# Altium schematic sheet PMP9517.SchDoc: Main Sheet
size 431 x 279 mm; Date: Not shown in title block; ApprovedBy: Not shown in title block; CheckedBy: Not shown in title block; Author: Not shown in title block; CompanyName: Not shown in title block; DrawnBy: Brian Gaynor; Engineer: Not shown in title block; Organization: Not shown in title block; Address1: Not shown in title block; Address2: Not shown in title block; Address3: Not shown in title block; Address4: Not shown in title block; DocumentNumber: 1; Revision: Use project parameter SCH_Rev; SheetNumber: 1; SheetTotal: 2; PageSetup: Record=PageOptions|CenterHorizontal=True|CenterVertical=True|PrintScale=0.66|XCorrection=1.00|YCorrection=1.00|PrintKind=0|BorderSize=5000000|LeftOffset=0|BottomOffset=0|Orientation=2|PaperLength=1000|PaperWidth=1000|Scale=100|PaperSource=15|PrintQuality=600|MediaType=1|DitherType=10|PaperKind=Letter|PrintScaleMode=1; CurrentTime: Not shown in title block; CurrentDate: Not shown in title block; Time: Not shown in title block; DocumentFullPathAndName: Not shown in title block; DocumentName: Not shown in title block; ModifiedDate: Not shown in title block; ImagePath: Not shown in title block
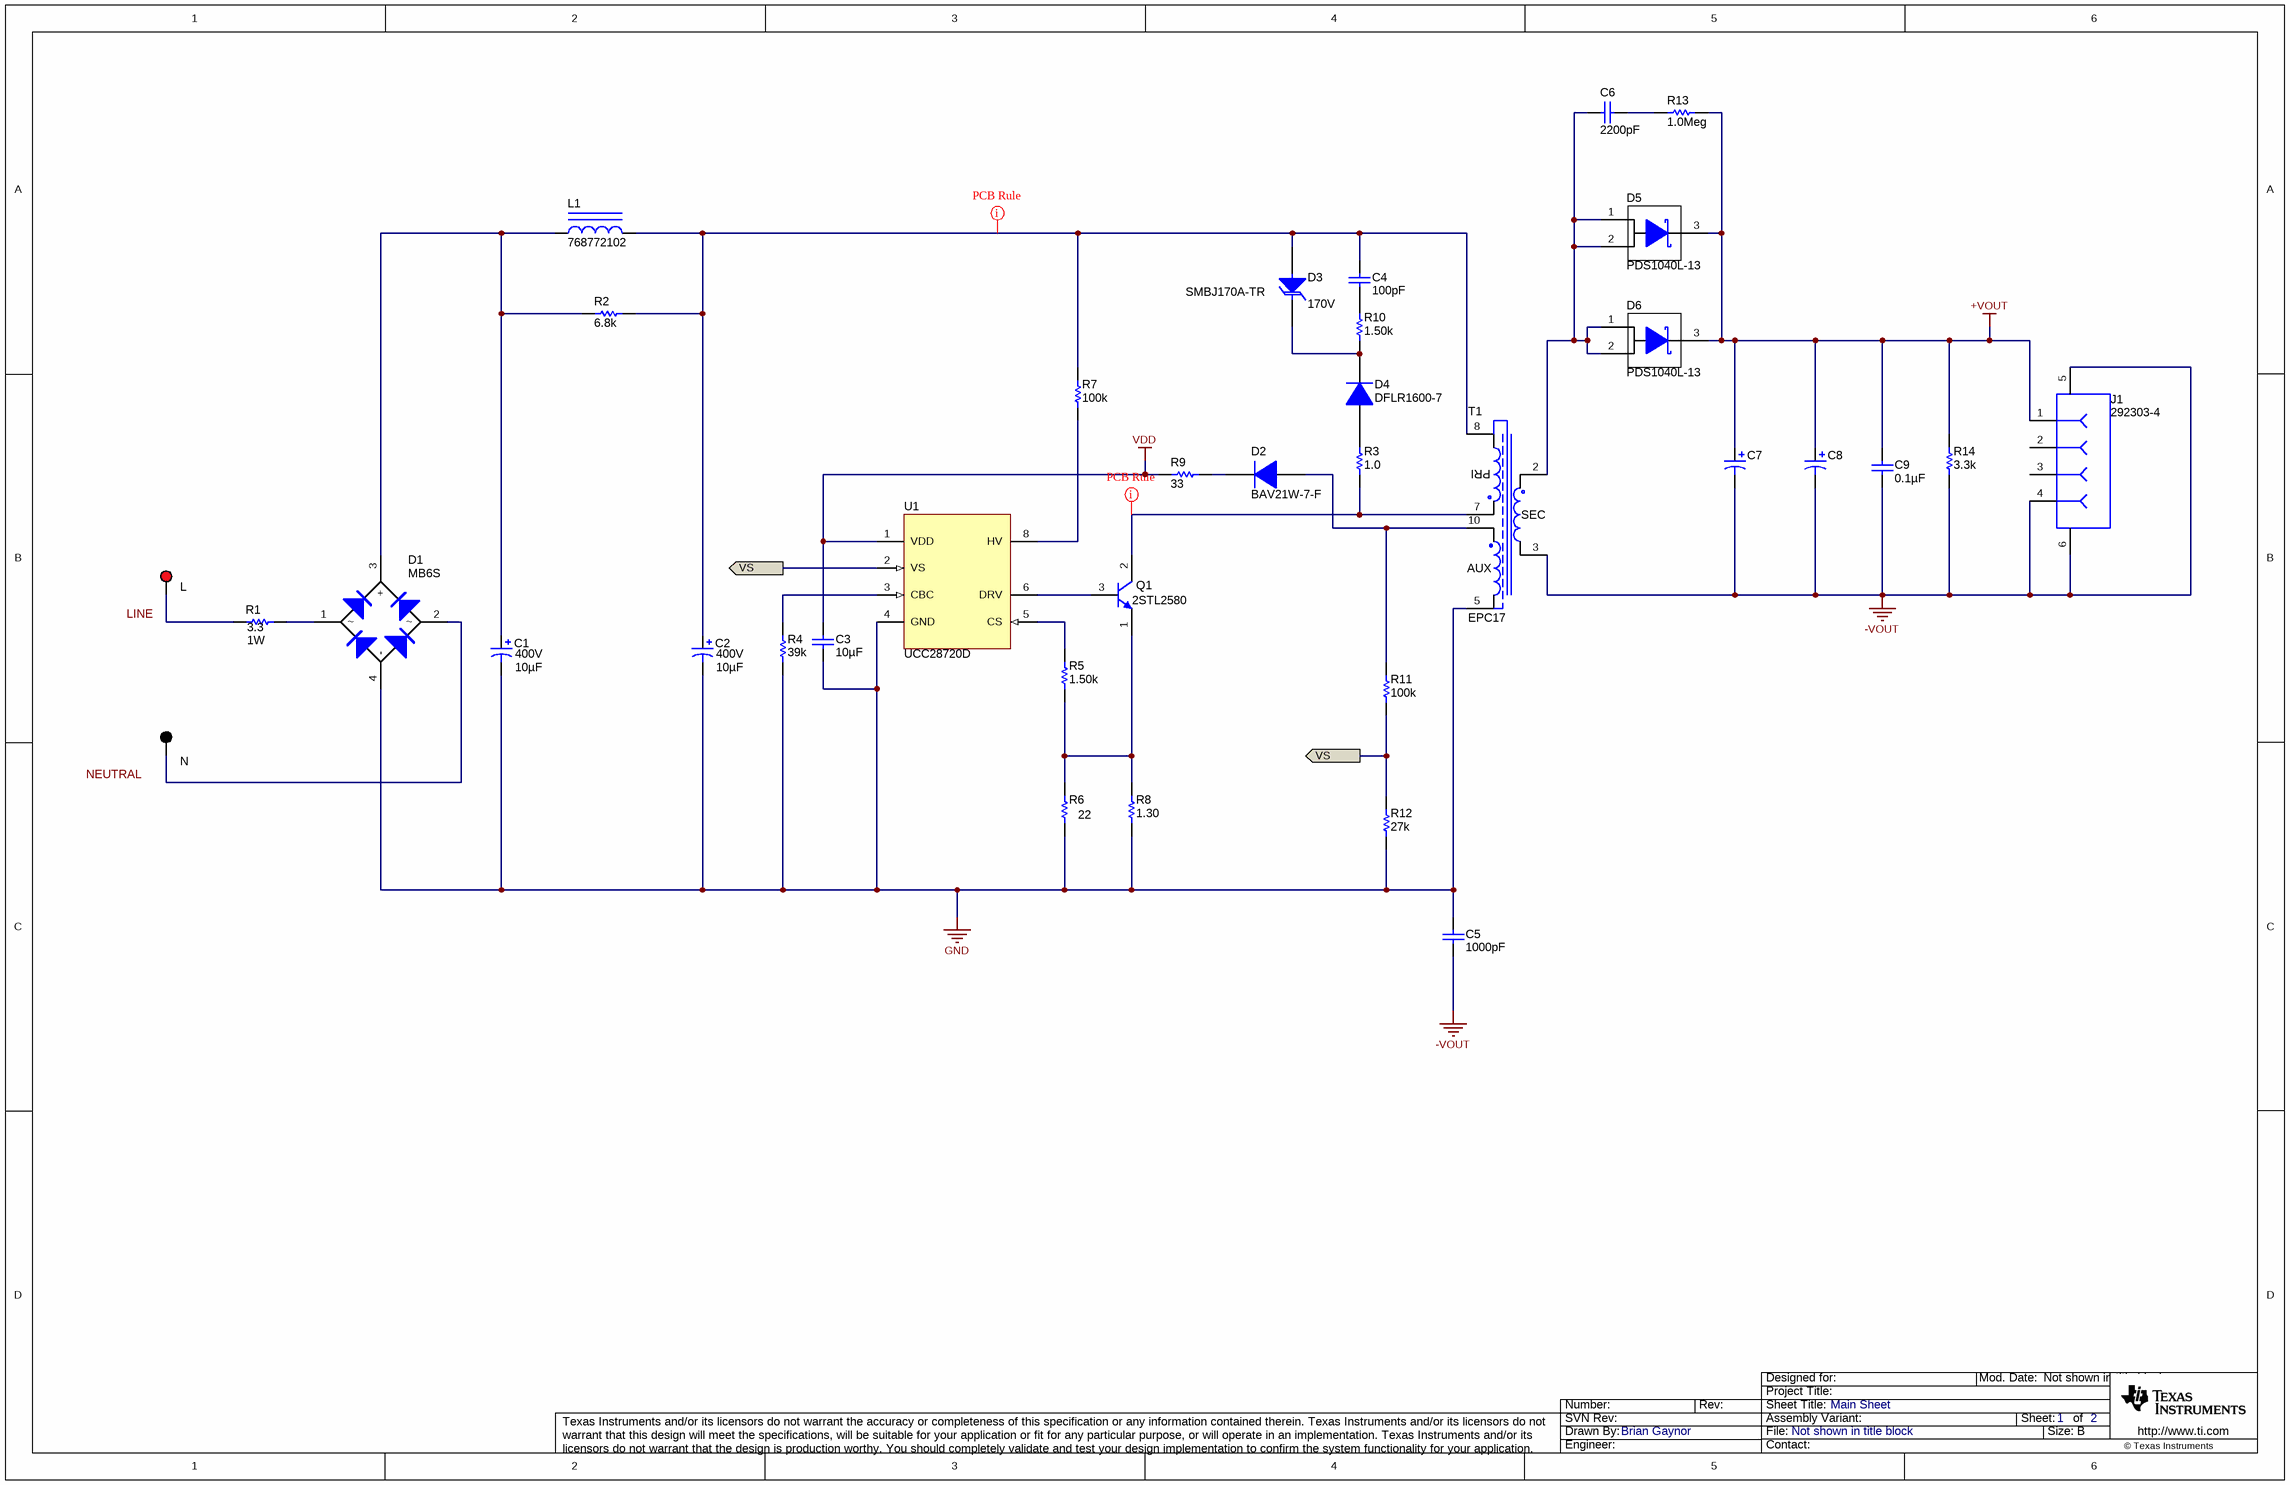
[diagram p0: PMP9517.SchDoc]

## Parts
C1  value 10µF  VDC_V: 400V  [CAPPRD500W60D1000H1250]  (hidden comment: UVC2G100MPD)
C2  value 10µF  VDC_V: 400V  [CAPPRD500W60D1000H1250]  (hidden comment: UVC2G100MPD)
C3  ValueDisplayed: 10µF  [1210]  (hidden comment: 1210YD106KAT2A)
C4  ValueDisplayed: 100pF  [1206]  (hidden comment: C1206C101JCGACTU)
C5  ValueDisplayed: 1000pF  [CAPRD750W60D750H1050]  (hidden comment: VY2102M29Y5UG63V7)
C6  ValueDisplayed: 2200pF  [0805_HV]  (hidden comment: 08055C222KAT2A)
C7  RNE0J122MDN1PX  [NRE-AX_800x1080]  (value not drawn)
C8  CAP ALUM 1200UF 6.3V 20% RADIAL  [NRE-AX_800x1080]  (value not drawn)
C9  ValueDisplayed: 0.1µF  [0805_HV]  (hidden comment: 08055C104JAT2A)
D1  MB6S  [MiniDIP-MB6S]
D2  BAV21W-7-F  [SOD-123]
D3  SMBJ170A-TR  value 170V  [SMB]
D4  DFLR1600-7  [powerDI123]
D5  PDS1040L-13  [powerdi5]
D6  PDS1040L-13  [powerdi5]
J1  292303-4  [CONN_TE_292303-4]
L  5005  [Keystone5005]  (value not drawn)
L1  768772102  [IND_WE-TI_8095]
N  5006  [Keystone5006]  (value not drawn)
Q1  2STL2580  [TO-92_AllBent]
R1  value 3.3  Power_W: 1W  [RES_ERG1S_V]  (hidden comment: SPP1UL3R30JLF)
R2  value 6.8k  [0805_HV]  (hidden comment: CRCW08056K80JNEA)
R3  value 1.0  [1206]  (hidden comment: CRCW12061R00JNEA)
R4  value 39k  [0603]  (hidden comment: CRCW060339K0JNEA)
R5  value 1.50k  [0603]  (hidden comment: CRCW06031K50FKEA)
R6  value 22  [2512M]  (hidden comment: CRCW251222R0JNEGHP)
R7  value 100k  [1206]  (hidden comment: RC1206FR-07100KL)
R8  value 1.30  [2512M]  (hidden comment: ERJ-1TRQF1R3U)
R9  value 33  [0603]  (hidden comment: CRCW060333R0JNEA)
R10  value 1.50k  [1206]  (hidden comment: CRCW12061K50FKEA)
R11  value 100k  [0603]  (hidden comment: CRCW0603100KFKEA)
R12  value 27k  [0603]  (hidden comment: RC0603JR-0727KL)
R13  value 1.0Meg  [0805_HV]  (hidden comment: CRCW08051M00JNEA)
R14  value 3.3k  [0805_HV]  (hidden comment: CRCW08053K30JNEA)
T1  EPC17  [MAG\TH\EPC17]
U1  UCC28720D  [D0007A_N]

## Ports
VS

## Nets
+VOUT: C7.1(+) C8.1(+) C9.2 D5.3(K) D6.3(K) J1.1 R13.2 R14.2
-VOUT: C5.2 C7.2(-) C8.2(-) C9.1 J1.4 J1.5 J1.6 R14.1 T1.3
GND: C1.2(-) C2.2(-) C3.2 C5.1 D1.4(-) R4.1 R6.1 R8.1 R12.1 T1.5 U1.4(GND)
VDD: C3.1 R9.1 U1.1(VDD)
VS: R11.1 R12.2 U1.2(VS) ; port VS
NetC1_1: C1.1(+) D1.3(+) L1.1 R2.1
NetC2_1: C2.1(+) C4.1 D3.2(A) L1.2 R2.2 R7.1 T1.8
NetC4_2: C4.2 R10.2
NetC6_1: C6.1 D5.1(A) D5.2(A) D6.1(A) D6.2(A) T1.2
NetC6_2: C6.2 R13.1
NetD1_1: D1.1 R1.2
NetD1_2: D1.2 N.1
NetD2_1: D2.1(K) R9.2
NetD2_2: D2.2(A) R11.2 T1.10
NetD3_1: D3.1(K) D4.1(K) R10.1
NetD4_2: D4.2(A) R3.2
NetL_1: L.1 R1.1
NetQ1_1: Q1.1(B) R5.1 R6.2 R8.2
NetQ1_2: Q1.2(C) R3.1 T1.7
NetQ1_3: Q1.3(E) U1.6(DRV)
NetR4_2: R4.2 U1.3(CBC)
NetR5_2: R5.2 U1.5(CS)
NetR7_2: R7.2 U1.8(HV)

Not connected (* = marked no-connect by the designer): J1 2 3

## Layout directives
rule Clearance Constraint [Clearance = 1mm]: NetC2_1, NetQ1_2

## Notes on the sheet
- Labels drawn without touching a wire or pin: LINE, NEUTRAL
- Drawn By:
- SVN Rev:
- Number:
- Rev:
- Sheet Title:
- File:
- Project Title:
- Designed for:
- Assembly Variant:
- Mod. Date:
- Sheet:
- Size:
- of
- B
- http://www.ti.com
- Texas Instruments and/or its licensors do not warrant the accuracy or completeness of this specification or any information contained therein. Texas Instruments and/or its licensors do not warrant that this design will meet the specifications, will be suitable for your application or fit for any particular purpose, or will operate in an implementation. Texas Instruments and/or its licensors do not warrant that the design is production worthy. You should completely validate and test your design implementation to confirm the system functionality for your application.
- Engineer:
- Contact:
- © Texas Instruments
- (in symbol EPC17) PRI; SEC; AUX

## Library data of the parts
C1 C2 = Capacitor_Polarized: CAP, [Technology], xxxF, xxV, +/-xx%, xxOhm ESR, [MountType]; Manufacturer: Nichicon; Description: CAP ALUM 10UF 400V 20% RADIAL; Ripple Current: 100mA; Lifetime @ Temp.: 2000 Hrs @ 105°C; Tolerance_%: ±20%; PartNumber: UVC2G100MPD; Supplier Part Number: 493-6677-ND; Category: Capacitors; Supplier: Digi-Key; Impedance: -; MountType: Through Hole; Height - Seated (Max): 0.571" (14.50mm); Lead Spacing: 0.197" (5.00mm); Packaging: Bulk; Applications: General Purpose; Surface Mount Land Size: -; Size / Dimension: 0.394" Dia (10.00mm); PackageReference: Radial, Can; ESR_Ohm: -; Operating Temperature: -40°C ~ 105°C; Type: -; RoHS: RoHS Compliant
C3 = 1210YD106KAT2A: CAP, CERM, 10uF, 16V, +/-10%, X5R, 1210; Manufacturer: AVX; Polarized: N; CompType: Capacitor; U/M: EA; Cap_F: 0.00001; Tolerance_%: 10; Value1: Unknown; VDC_V: 16; TaMin_C: -55; TaMax_C: 85; SymbolVersion: 2008-07-09; Value: 10uF; PackageReference: 1210; PartNumber: 1210YD106KAT2A; RoHS: Y; MountType: SMT; ComponentLink1Description: Datasheet link; ComponentLink1URL: http://www.avx.com/docs/Catalogs/cx5r.pdf; Publisher: Texas Instruments; LatestRevisionDate: 2013-06-21; Value2: 16V; Technology: Ceramic; Cap_Case: 1210; Supplier 1: Digi-Key; Supplier Part Number 1: 478-1629-1-ND; Supplier 2: Mouser; Supplier Part Number 2: 581-1210YD106K; Supplier 3: Newark; Supplier Part Number 3: 10R6031; TempCo: X5R; Published: 2008-06-19
C4 = C1206C101JCGACTU: CAP, CERM, 100pF, 500V, +/-5%, C0G/NP0, 1206; Manufacturer: Kemet; Polarized: N; CompType: Capacitor; U/M: EA; Cap_F: 0.0000000001; Tolerance_%: 5; Value1: Unknown; VDC_V: 500; TaMin_C: -55; TaMax_C: 125; SymbolVersion: 2008-07-09; Value: 100pF; PackageReference: 1206; PartNumber: C1206C101JCGACTU; RoHS: Y; MountType: SMT; ComponentLink1Description: Datasheet link; ComponentLink1URL: http://www.kemet.com/datasheets&C1206C101JCGACTU; Publisher: Texas Instruments; LatestRevisionDate: 2013-03-03; LatestRevisionNote: Changed publisher; Value2: 500V; Technology: Ceramic; TempCo: C0G/NP0; Cap_Case: 1206; Published: 2008-06-19; Supplier 1: Digi-Key; Supplier Part Number 1: 399-7073-2-ND; Supplier 2: Mouser; Supplier Part Number 2: 80-C1206C101JCG; Supplier 3: Newark; Supplier Part Number 3: 13K5663
C5 = VY2102M29Y5UG63V7: CAP, CERM, 1000pF, 300V, +/-20%, Y5U, Radial Disc 7.5mm, ls=7.5; Manufacturer: Vishay-Bccomponents; Polarized: N; CompType: Capacitor; U/M: EA; Cap_F: 0.000000001; Tolerance_%: 20; Value1: Unknown; VDC_V: 300; TaMin_C: -40; TaMax_C: 125; SymbolVersion: 2008-07-09; Value: 1000pF; PartNumber: VY2102M29Y5UG63V7; PackageReference: Radial Disc 7.5mm, ls=7.5; RoHS: Y; Value2: 300V; MountType: TH; Technology: Ceramic; TempCo: Y5U; Cap_Case: Radial Disc 7.5mm, ls=7.5; Published: 2008-06-19; Publisher: Texas Instruments; LatestRevisionDate: 2013-09-06; ComponentLink1Description: Datasheet link; ComponentLink1URL: http://www.vishay.com/docs/28535/emirfiy2.pdf; Supplier 1: Digi-Key; Supplier Part Number 1: BC2752-ND; Supplier 2: Mouser; Supplier Part Number 2: 72-VY2102M29Y5UG63V7; Supplier 3: Farnell; Supplier Part Number 3: 1902243
C6 = 08055C222KAT2A: CAP, CERM, 2200pF, 50V, +/-10%, X7R, 0805; Manufacturer: AVX; Polarized: N; CompType: Capacitor; U/M: EA; Cap_F: 0.0000000022; Tolerance_%: 10; ESR_Ohm: 0.183; Value1: 0.183 ohm; VDC_V: 50; TaMin_C: -55; TaMax_C: 125; Cap_Case: 0805; SymbolVersion: 2008-07-09; Value: 2200pF; PartNumber: 08055C222KAT2A; PackageReference: 0805; RoHS: Y; Value2: 50V; MountType: SMT; Technology: Ceramic; TempCo: X7R; Published: 2008-06-19; Publisher: Texas Instruments; LatestRevisionDate: 2013-03-03; LatestRevisionNote: Changed publisher; ComponentLink1Description: Datasheet link; ComponentLink1URL: http://www.avx.com/docs/masterpubs/smccp.pdf; Supplier 1: Digi-Key; Supplier Part Number 1: 478-1375-1-ND; Supplier 2: Mouser; Supplier Part Number 2: 581-08055C222K; Supplier 3: Farnell; Supplier Part Number 3: 498610
C7 = Capacitor_Polarized: CAP, [Technology], xxxF, xxV, +/-xx%, xxOhm ESR, [MountType]; Manufacturer: Nichicon; Ripple Current: 5.7A; Tolerance_%: ±20%; Description: CAP ALUM 1200UF 6.3V 20% RADIAL; Type: Polymer; Lifetime @ Temp.: 2000 Hrs @ 105°C; Value: 1200µF; ESR_Ohm: 10 mOhm; VDC_V: 6.3V; MountType: Through Hole; PackageReference: Radial, Can; PartNumber: RNE0J122MDN1PX; Category: Capacitors; Applications: -; RoHS: RoHS Compliant; Impedance: -; Operating Temperature: -55°C ~ 105°C; Lead Spacing: 0.138" (3.50mm); Supplier: Digi-Key; Surface Mount Land Size: -; Height - Seated (Max): 0.354" (9.00mm); Size / Dimension: 0.315" Dia (8.00mm); Packaging: Tape & Reel (TR); Supplier Part Number: 493-3811-2-ND
C8 = Capacitor_Polarized: CAP, [Technology], xxxF, xxV, +/-xx%, xxOhm ESR, [MountType]; PartNumber: RNE0J122MDN1PX; Manufacturer: Nichicon; Ripple Current: 5.7A; Type: Polymer; Lifetime @ Temp.: 2000 Hrs @ 105°C; Value: 1200µF; ESR_Ohm: 10 mOhm; MountType: Through Hole; PackageReference: Radial, Can; Category: Capacitors; Tolerance_%: ±20%; Description: CAP ALUM 1200UF 6.3V 20% RADIAL; Applications: -; RoHS: RoHS Compliant; Impedance: -; Operating Temperature: -55°C ~ 105°C; Lead Spacing: 0.138" (3.50mm); Supplier: Digi-Key; Surface Mount Land Size: -; Height - Seated (Max): 0.354" (9.00mm); Size / Dimension: 0.315" Dia (8.00mm); Packaging: Tape & Reel (TR); VDC_V: 6.3V; Supplier Part Number: 493-3811-2-ND
C9 = 08055C104JAT2A: CAP, CERM, 0.1uF, 50V, +/-5%, X7R, 0805; Manufacturer: AVX; Polarized: N; CompType: Capacitor; U/M: EA; Cap_F: 0.0000001; Tolerance_%: 5; ESR_Ohm: 0.024; Value1: 0.024 ohm; VDC_V: 50; TaMin_C: -55; TaMax_C: 125; Cap_Case: 0805; SymbolVersion: 2008-07-09; Value: 0.1uF; PartNumber: 08055C104JAT2A; PackageReference: 0805; RoHS: Y; Value2: 50V; MountType: SMT; Technology: Ceramic; TempCo: X7R; Published: 2008-06-19; Publisher: Texas Instruments; LatestRevisionDate: 2013-07-02; ComponentLink1Description: Datasheet link; ComponentLink1URL: http://www.avx.com/docs/masterpubs/smccp.pdf; Supplier 1: Digi-Key; Supplier Part Number 1: 478-3352-1-ND; Supplier 2: Mouser; Supplier Part Number 2: 581-08055C104J; Supplier 3: Farnell; Supplier Part Number 3: 1740673
D1 = MB6S: Diode, Switching-Bridge, 600V, 1A, TH; U/M: EA; Io_A: 1; CompType: Diode; PackageReference: Diodge Bridge; PartNumber: MB6S; RoHS: Y; MountType: TH; ComponentLink1Description: Datasheet link; Type: Switching-Bridge; Supplier 1: Mouser; Supplier Part Number 1: 512-MB6S
D2 = BAV21W-7-F: Diode, Switching, 200V, 0.2A, SOD-123; Manufacturer: Diodes Inc.; Value: 1.25V; U/M: EA; Vf_V: 1.25; Io_A: 0.2; Vr_V: 200; TJmax_C: 150; CompType: Diode; PartNumber: BAV21W-7-F; SymbolVersion: 2008-12-08; MountType: SMT; RoHS: Y; PackageReference: SOD-123; ComponentLink1Description: Datasheet link; ComponentLink1URL: http://www.diodes.com/datasheets/ds12024.pdf; Publisher: Texas Instruments; LatestRevisionDate: 2013-03-05; Value1: 0.2A; Value2: 200V; Type: Switching; Published: 2008-06-26; Supplier 1: Digi-Key; Supplier Part Number 1: BAV21W-FDICT-ND; Supplier 2: Mouser; Supplier Part Number 2: 621-BAV21W-F; Supplier 3: Farnell; Supplier Part Number 3: 1858652
D3 = SMBJ170A-TR: Diode, TVS, Uni, 170V, 600W, SMB; Manufacturer: ST Microelectronics; U/M: EA; Power_W: 600; Vr_V: 170; CompType: TVS; SymbolVersion: 2012-01-13; PackageReference: SMB; PartNumber: SMBJ170A-TR; RoHS: Y; MountType: SMT; ComponentLink1Description: Datasheet link; ComponentLink1URL: http://www.st.com/web/en/resource/technical/document/datasheet/CD00001366.pdf; Publisher: Texas Instruments; LatestRevisionDate: 2013-03-11; LatestRevisionNote: Updated Supplier Data; Vz_V: N/A; Value1: 600W; Published: 2008-10-08; Supplier 1: Digi-Key; Supplier Part Number 1: 497-6511-1-ND; Supplier 2: Mouser; Supplier Part Number 2: 511-SMBJ170A-TR; Supplier 3: Farnell; Supplier Part Number 3: 9886133
D4 = Diode: Diode, [Type], xxxV, x.xxA, [PackageReference]; Manufacturer: Diodes Inc; Value: 1.1V @ 1A; Vr_V: 600V; Speed: Standard Recovery >500ns, > 200mA (Io); Thermal Resistance: 6°C/W Jl; Capacitance @ Vr, F: 10pF @ 4V, 1MHz; Io_A: 1A; Type: Standard; Current - Reverse Leakage @ Vr: 3µA @ 600V; Description: DIODE GP 600V 1A POWERDI123; PartNumber: DFLR1600-7; Packaging: Cut Tape (CT); Reverse Recovery Time (trr): -; RoHS: RoHS Compliant; PackageReference: 2-SMD, Flat Lead; MountType: Surface Mount; Junction Operating Temp: -65°C ~ 150°C; Supplier Device Package: PowerDI™ 123; Supplier: Digi-Key; Supplier Part Number: DFLR1600-7DICT-ND; Category: Discrete Semiconductor Products
D5 D6 = 30WQ04FNPBF: Diode, Schottky, 40V, 3.5A, DPAK; Manufacturer: Diodes Inc; Description: DIODE SCHOTTKY 40V 10A POWERDI5; Thermal Resistance: 1.5°C/W Jl; Current - Reverse Leakage @ Vr: 600µA @ 40V; Speed: Fast Recovery =< 500ns, > 200mA (Io); Value: 490mV @ 10A; Io_A: 10A; Supplier Part Number: PDS1040LDITR-ND; Supplier: Digi-Key; PartNumber: PDS1040L-13; Category: Discrete Semiconductor Products; PackageReference: PowerDI™ 5; Junction Operating Temp: -65°C ~ 150°C; Reverse Recovery Time (trr): -; Vr_V: 40V; MountType: Surface Mount; RoHS: RoHS Compliant; Supplier Device Package: PowerDI®5; Packaging: Tape & Reel (TR); Capacitance @ Vr, F: -; Type: Schottky
J1 = 292303-4: Connector, USB Type A, Receptacle, R/A, TH; Manufacturer: TE Connectivity; SymbolCreator: a0412235; U/M: EA; SymbolVersion: 2013-03-24; PartNumber: 292303-4; PackageReference: USB Type A right angle; CompType: Connector; RoHS: Y; MountType: TH; ComponentLink1Description: Datasheet Link; ComponentLink1URL: http://www.te.com/commerce/DocumentDelivery/DDEController?Action=showdoc&DocId=Customer+Drawing%7F292303%7FE8%7Fpdf%7FEnglish%7FENG_CD_292303_E8.pdf%7F292303-4; Publisher: Texas Instruments; LatestRevisionDate: 2013-12-12; Supplier 1: Digi-Key; Supplier Part Number 1: 292303-4-ND; Supplier 2: Mouser; Supplier Part Number 2: 571-292303-4
L = 5005: Test Point, Compact, Red, TH; Manufacturer: Keystone; CompType: Test Point Loop; U/M: EA; SymbolVersion: 2008-04-04; PartNumber: 5005; Value: Red; RoHS: Y; PackageReference: Red Compact Testpoint; MountType: TH; ComponentLink1Description: Datasheet Link; ComponentLink1URL: http://www.keyelco.com/userAssets/file/M60-2p60.pdf; Publisher: Texas Instruments; LatestRevisionDate: 2013-07-26; Supplier 1: Digi-Key; Supplier Part Number 1: 5005K-ND
L1 = 768772102: Inductor, Shielded Drum Core, Metal Composite, 1mH, 0.5A, 1.7 ohm, TH; Manufacturer: Wurth Elektronik eiSos; DCR_ohm: 1.7; Ind_H: 1.0E-3; Imax_A: 0.5; Irms: 0.5A @ 40C rise; Isat: 0.55A @ 10% inductance drop; Value1: 1.7 ohm; U/M: EA; RoHS: Y; PartNumber: 768772102; MountType: TH; ValueDisplayed: 1mH; PackageReference: Dia 8x10mm; SymbolVersion: 2008-07-23; CompType: Inductor; Value: 1mH; Value2: 0.5A; Technology: Shielded Drum Core; Material: Metal Composite; Published: 2008-06-26; Publisher: Texas Instruments; LatestRevisionDate: 2013-11-12; ComponentLink1Description: Datasheet link; ComponentLink1URL: http://katalog.we-online.de/kataloge/eisos/media/pdf/768772102.pdf; Supplier 1: Digi-Key; Supplier Part Number 1: 732-3261-ND
N = 5006: Test Point, Compact, Black, TH; Manufacturer: Keystone; CompType: Test Point Loop; U/M: EA; SymbolVersion: 2008-04-04; PartNumber: 5006; Value: Black; RoHS: Y; PackageReference: Black Compact Testpoint; MountType: TH; ComponentLink1Description: Datasheet Link; ComponentLink1URL: http://www.keyelco.com/userAssets/file/M60-2p60.pdf; Publisher: Texas Instruments; LatestRevisionDate: 2013-07-26; Supplier 1: Digi-Key; Supplier Part Number 1: 5006K-ND
Q1 = STBV32-AP, ST Microelectronics: Transistor, NPN, 400V, 1.5A, TO-92AP; DC Collector/Base Gain hfe Min: 60 V; Maximum DC Collector Current: 2 A; Maximum Power Dissipation: 1.5 W; Product Status: New at Mouser; Emitter- Base Voltage VEBO: 9 V; Description: Transistors Bipolar - BJT High Volt NPN Trans 800V Vces 400V Vceo; Continuous Collector Current: 1 A; Reeling: False; Category: Transistors Bipolar - BJT; RoHS - Mouser: Y; Mounting Style: Through Hole; Product Category: Power Bipolar Transistors; Minimum Order Quantity: 1; Supplier Part Number: 511-2STL2580; PackageReference: TO-92MOD; PartNumber: 2STL2580; Supplier: Mouser; Collector- Emitter Voltage VCEO Max: 400 V; Packaging: Bulk; RoHS: RoHS Compliant; Manufacturer: STMicroelectronics; Transistor Polarity: NPN
R1 = Resistor: RES, xxx ohm, x%, xW, [PackageReference]; Manufacturer: TT Electronics/IRC; Description: RES 3.3 OHM 1W 5% AXIAL; TempCo: ±300ppm/°C; Tolerance_%: ±5%; PackageReference: Axial; PartNumber: SPP1UL3R30JLF; Packaging: Tape & Reel (TR); Technology: Wirewound; RoHS: RoHS Compliant; Number of Terminations: 2; Supplier Part Number: 989-1258-2-ND; Supplier: Digi-Key; Supplier Device Package: Axial; Size / Dimension: 0.150" Dia x 0.402" L (3.80mm x 10.20mm); Height: -; Category: Resistors
R2 = CRCW08056K80JNEA: RES, 6.8k ohm, 5%, 0.125W, 0805; Manufacturer: Vishay-Dale; CompType: Resistor; Res_ohm: 6800; Value_Code: 6k80; Tolerance_%: 5; Power_W: 0.125; VDC_V: 150; TempCo: 200 ppm/C; EIA_Code: E24; U/M: EA; SymbolVersion: 2009-05-29; PartNumber: CRCW08056K80JNEA; PackageReference: 0805; RoHS: Y; Value1: 5%; Value2: 0.125W; MountType: SMT; Technology: Thick Film; Published: 2008-06-26; Publisher: Texas Instruments; LatestRevisionDate: 2013-04-29; ComponentLink1Description: Datasheet link; ComponentLink1URL: http://www.vishay.com/docs/20035/dcrcwe3.pdf; Supplier 1: Mouser; Supplier Part Number 1: 71-CRCW08056K80JNEA; Supplier 2: Farnell; Supplier Part Number 2: 1537444; Supplier 3: Newark; Supplier Part Number 3: 59M8586
R3 = CRCW12061R00JNEA: RES, 1.0 ohm, 5%, 0.25W, 1206; Manufacturer: Vishay-Dale; CompType: Resistor; Res_ohm: 1; Value_Code: 1R00; Tolerance_%: 5; Power_W: 0.25; VDC_V: 200; TempCo: 200 ppm/C; EIA_Code: E24; U/M: EA; SymbolVersion: 2009-05-29; PartNumber: CRCW12061R00JNEA; PackageReference: 1206; RoHS: Y; Value1: 5%; Value2: 0.25W; MountType: SMT; Technology: Thick Film; Published: 2008-06-26; Publisher: Texas Instruments; LatestRevisionDate: 2013-10-09; ComponentLink1Description: Datasheet link; ComponentLink1URL: http://www.vishay.com/docs/20035/dcrcwe3.pdf; Supplier 1: Digi-Key; Supplier Part Number 1: 541-1.0ECT-ND; Supplier 2: Mouser; Supplier Part Number 2: 71-CRCW1206J-1.0-E3; Supplier 3: Farnell; Supplier Part Number 3: 1540467
R4 = CRCW060339K0JNEA: RES, 39k ohm, 5%, 0.1W, 0603; Manufacturer: Vishay-Dale; CompType: Resistor; Res_ohm: 39000; Value_Code: 39k0; Tolerance_%: 5; Power_W: 0.1; VDC_V: 75; TempCo: 200 ppm/C; EIA_Code: E24; U/M: EA; SymbolVersion: 2009-05-29; PartNumber: CRCW060339K0JNEA; PackageReference: 0603; RoHS: Y; Value1: 5%; Value2: 0.1W; MountType: SMT; Technology: Thick Film; Published: 2008-06-26; Publisher: Texas Instruments; LatestRevisionDate: 2013-08-23; ComponentLink1Description: Datasheet link; ComponentLink1URL: http://www.vishay.com/docs/20035/dcrcwe3.pdf; Supplier 1: Mouser; Supplier Part Number 1: 71-CRCW0603J-39K-E3; Supplier 2: Farnell; Supplier Part Number 2: 1514761; Supplier 3: Newark; Supplier Part Number 3: 59M6807
R5 = CRCW06031K50FKEA: RES, 1.50k ohm, 1%, 0.1W, 0603; Manufacturer: Vishay-Dale; CompType: Resistor; Res_ohm: 1500; Value_Code: 1k50; Tolerance_%: 1; Power_W: 0.1; VDC_V: 75; TempCo: 100 ppm/C; EIA_Code: E96; U/M: EA; SymbolVersion: 2009-05-29; PartNumber: CRCW06031K50FKEA; PackageReference: 0603; RoHS: Y; Value1: 1%; Value2: 0.1W; MountType: SMT; Technology: Thick Film; Published: 2008-06-26; Publisher: Texas Instruments; LatestRevisionDate: 2013-08-23; ComponentLink1Description: Datasheet link; ComponentLink1URL: http://www.vishay.com/docs/20035/dcrcwe3.pdf; Supplier 1: Digi-Key; Supplier Part Number 1: 541-1.50KHCT-ND; Supplier 2: Mouser; Supplier Part Number 2: 71-CRCW0603-1.5K-E3; Supplier 3: Farnell; Supplier Part Number 3: 1469743
R6 = CRCW251222R0JNEGHP: RES, 22 ohm, 5%, 1.5W, 2512; Manufacturer: Vishay-Dale; CompType: Resistor; Value_Code: 22R0; Tolerance_%: 5; Power_W: 1.5; VDC_V: 500; TempCo: 200 ppm/C; EIA_Code: E24; U/M: EA; SymbolVersion: 2009-05-29; PartNumber: CRCW251222R0JNEGHP; PackageReference: 2512; RoHS: Y; Res_ohm: 22; Value1: 5%; Value2: 1.5W; MountType: SMT; Technology: Thick Film; Published: 2008-06-26; Publisher: Texas Instruments; LatestRevisionDate: 2013-11-25; ComponentLink1Description: Datasheet link; ComponentLink1URL: http://www.vishay.com/docs/20043/crcwhpe3.pdf; Supplier 1: Digi-Key; Supplier Part Number 1: 541-22RACT-ND; Supplier 2: Mouser; Supplier Part Number 2: 71-CRCW251222R0JNEGH
R7 = RC1206FR-07100KL: RES, 100k ohm, 1%, 0.25W, 1206; Manufacturer: Yageo America; CompType: Resistor; Res_ohm: 100000; Tolerance_%: 1; Power_W: 0.25; VDC_V: 200; TempCo: 100 ppm/C; EIA_Code: E96; U/M: EA; SymbolVersion: 2009-05-29; PartNumber: RC1206FR-07100KL; PackageReference: 1206; RoHS: Y; Value_Code: 100k; Value1: 1%; Value2: 0.25W; MountType: SMT; Technology: Thick Film; Published: 2008-06-26; Publisher: Texas Instruments; LatestRevisionDate: 2013-09-05; ComponentLink1Description: Datasheet link; ComponentLink1URL: http://www.yageo.com/pdf/Pu-RC1206_51_PbFree_L_2.pdf; Supplier 1: Digi-Key; Supplier Part Number 1: 311-100KFRCT-ND; Supplier 2: Mouser; Supplier Part Number 2: 603-RC1206FR-07100KL; Supplier 3: Farnell; Supplier Part Number 3: 9241060
R8 = ERJ-1TRQF1R3U: RES, 1.30 ohm, 1%, 1W, 2512; Manufacturer: Panasonic; CompType: Resistor; Res_ohm: 1.3; Value_Code: 1R30; Tolerance_%: 1; TempCo: 100 ppm/C; EIA_Code: E96; U/M: EA; SymbolVersion: 2009-05-29; PartNumber: ERJ-1TRQF1R3U; PackageReference: 2512; RoHS: Y; Value1: 1%; Power_W: 1; Value2: 1W; MountType: SMT; Technology: Thick Film; Published: 2008-06-26; Publisher: Texas Instruments; LatestRevisionDate: 2013-11-25; ComponentLink1Description: Datasheet link; ComponentLink1URL: http://industrial.panasonic.com/www-data/pdf/AOA0000/AOA0000CE3.pdf; Supplier 1: Digi-Key; Supplier Part Number 1: PT1.3YCT-ND; Supplier 2: Mouser; Supplier Part Number 2: 667-ERJ-1TRQF1R3U; Supplier 3: Farnell; Supplier Part Number 3: 1893032
R9 = CRCW060333R0JNEA: RES, 33 ohm, 5%, 0.1W, 0603; Manufacturer: Vishay-Dale; CompType: Resistor; Value_Code: 33R0; Tolerance_%: 5; Power_W: 0.1; VDC_V: 75; TempCo: 200 ppm/C; EIA_Code: E24; U/M: EA; SymbolVersion: 2009-05-29; PartNumber: CRCW060333R0JNEA; PackageReference: 0603; RoHS: Y; Res_ohm: 33; Value1: 5%; Value2: 0.1W; MountType: SMT; Technology: Thick Film; Published: 2008-06-26; Publisher: Texas Instruments; LatestRevisionDate: 2013-01-08; ComponentLink1Description: Datasheet link; ComponentLink1URL: http://www.vishay.com/docs/20035/dcrcwe3.pdf; Supplier 1: Digi-Key; Supplier Part Number 1: 541-33GCT-ND; Supplier 2: Mouser; Supplier Part Number 2: 71-CRCW0603J-33-E3; Supplier 3: Farnell; Supplier Part Number 3: 1692524
R10 = CRCW12061K50FKEA: RES, 1.50k ohm, 1%, 0.25W, 1206; Manufacturer: Vishay-Dale; CompType: Resistor; Res_ohm: 1500; Value_Code: 1k50; Tolerance_%: 1; Power_W: 0.25; VDC_V: 200; TempCo: 100 ppm/C; EIA_Code: E96; U/M: EA; SymbolVersion: 2009-05-29; PartNumber: CRCW12061K50FKEA; PackageReference: 1206; RoHS: Y; Value1: 1%; Value2: 0.25W; MountType: SMT; Technology: Thick Film; Published: 2008-06-26; Publisher: Texas Instruments; LatestRevisionDate: 2013-01-18; ComponentLink1Description: Datasheet link; ComponentLink1URL: http://www.vishay.com/docs/20035/dcrcwe3.pdf; Supplier 1: Digi-Key; Supplier Part Number 1: 541-1.50KFCT-ND; Supplier 2: Mouser; Supplier Part Number 2: 71-CRCW1206-1.5K-E3; Supplier 3: Farnell; Supplier Part Number 3: 1653081
R11 = CRCW0603100KFKEA: RES, 100k ohm, 1%, 0.1W, 0603; Manufacturer: Vishay-Dale; CompType: Resistor; Res_ohm: 100000; Tolerance_%: 1; Power_W: 0.1; VDC_V: 75; TempCo: 100 ppm/C; EIA_Code: E96; U/M: EA; SymbolVersion: 2009-05-29; PartNumber: CRCW0603100KFKEA; PackageReference: 0603; RoHS: Y; Value_Code: 100k; Value1: 1%; Value2: 0.1W; MountType: SMT; Technology: Thick Film; Published: 2008-06-26; Publisher: Texas Instruments; LatestRevisionDate: 2013-01-08; ComponentLink1Description: Datasheet link; ComponentLink1URL: http://www.vishay.com/docs/20035/dcrcwe3.pdf; Supplier 1: Digi-Key; Supplier Part Number 1: 541-100KHCT-ND; Supplier 2: Mouser; Supplier Part Number 2: 71-CRCW0603-100K-E3; Supplier 3: Farnell; Supplier Part Number 3: 1469649
R12 = RC0603JR-0727KL: RES, 27k ohm, 5%, 0.1W, 0603; Manufacturer: Yageo America; CompType: Resistor; Res_ohm: 27000; Value_Code: 27k0; Tolerance_%: 5; Power_W: 0.1; VDC_V: 50; TempCo: 100 ppm/C; EIA_Code: E24; U/M: EA; SymbolVersion: 2009-05-29; PartNumber: RC0603JR-0727KL; PackageReference: 0603; RoHS: Y; Value1: 5%; Value2: 0.1W; MountType: SMT; Technology: Thick Film; Published: 2008-06-26; Publisher: Texas Instruments; LatestRevisionDate: 2013-08-23; ComponentLink1Description: Datasheet link; ComponentLink1URL: http://www.yageo.com/pdf/Pu-RC0603_51_PbFree_L_2.pdf; Supplier 1: Digi-Key; Supplier Part Number 1: 311-27KGRCT-ND; Supplier 2: Mouser; Supplier Part Number 2: 603-RC0603JR-0727KL; Supplier 3: Farnell; Supplier Part Number 3: 9233555
R13 = CRCW08051M00JNEA: RES, 1.0Meg ohm, 5%, 0.125W, 0805; Manufacturer: Vishay-Dale; CompType: Resistor; Res_ohm: 1000000; Value_Code: 1M00; Tolerance_%: 5; Power_W: 0.125; VDC_V: 150; TempCo: 200 ppm/C; EIA_Code: E24; U/M: EA; SymbolVersion: 2009-05-29; PartNumber: CRCW08051M00JNEA; PackageReference: 0805; RoHS: Y; Value1: 5%; Value2: 0.125W; MountType: SMT; Technology: Thick Film; Published: 2008-06-26; Publisher: Texas Instruments; LatestRevisionDate: 2013-10-15; ComponentLink1Description: Datasheet link; ComponentLink1URL: http://www.vishay.com/docs/20035/dcrcwe3.pdf; Supplier 1: Digi-Key; Supplier Part Number 1: 541-1.0MACT-ND; Supplier 2: Mouser; Supplier Part Number 2: 71-CRCW0805J-1M-E3; Supplier 3: Farnell; Supplier Part Number 3: 1514803
R14 = CRCW08053K30JNEA: RES, 3.3k ohm, 5%, 0.125W, 0805; Manufacturer: Vishay-Dale; CompType: Resistor; Res_ohm: 3300; Value_Code: 3k30; Tolerance_%: 5; Power_W: 0.125; VDC_V: 150; TempCo: 200 ppm/C; EIA_Code: E24; U/M: EA; SymbolVersion: 2009-05-29; PartNumber: CRCW08053K30JNEA; PackageReference: 0805; RoHS: Y; Value1: 5%; Value2: 0.125W; MountType: SMT; Technology: Thick Film; Published: 2008-06-26; Publisher: Texas Instruments; LatestRevisionDate: 2013-10-15; ComponentLink1Description: Datasheet link; ComponentLink1URL: http://www.vishay.com/docs/20035/dcrcwe3.pdf; Supplier 1: Mouser; Supplier Part Number 1: 71-CRCW08053K30JNEA; Supplier 2: Farnell; Supplier Part Number 2: 1514847; Supplier 3: Newark; Supplier Part Number 3: 59M6884
T1 = EPC17: JohnGriffin; CompType: Transformer; U/M: EA; MountType: TH; RoHS: Y; Publisher: Texas Instruments; PartNumber: EPC17
U1 = UCC28720D: CONSTANT-VOLTAGE, CONSTANT-CURRENT CONTROLLER WITH PRIMARY SIDE REGULATION, D0007A; Alternate Manufacturer: None; Manufacturer: Texas Instruments; SymbolCreator: a0411947; CompType: IC; U/M: EA; SymbolVersion: 2013-03-01; PartNumber: UCC28720D; PackageReference: D0007A; MountType: SMT; ComponentLink1Description: Datasheet Link; ComponentLink1URL: https://sps06.itg.ti.com/sites/KMS/crossdivteams/altium/docs/ComponentDatasheets/UCC28720_Preliminary Datasheet.pdf; RoHS: Y; Publisher: Texas Instruments; LatestRevisionDate: 2013-09-12; LatestRevisionNote: Added Parts